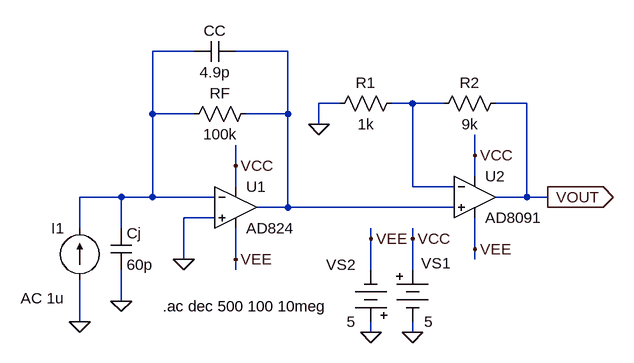
[diagram p0: schematic fig-03-03-19.asc]
fig-03-03-19.asc, the LTspice schematic file:
Version 4
SHEET 1 1132 680
WIRE 144 -64 80 -64
WIRE 288 -64 208 -64
WIRE 368 16 336 16
WIRE 480 16 448 16
WIRE 528 16 480 16
WIRE 656 16 608 16
WIRE 80 32 80 -64
WIRE 144 32 80 32
WIRE 288 32 288 -64
WIRE 288 32 224 32
WIRE 336 48 336 16
WIRE 576 96 576 64
WIRE 208 112 208 80
WIRE 576 128 576 96
WIRE 208 144 208 112
WIRE 480 144 480 16
WIRE 544 144 480 144
WIRE 32 160 -32 160
WIRE 80 160 80 32
WIRE 80 160 32 160
WIRE 176 160 80 160
WIRE 656 160 656 16
WIRE 656 160 608 160
WIRE 688 160 656 160
WIRE 288 176 288 32
WIRE 288 176 240 176
WIRE 544 176 288 176
WIRE 176 192 128 192
WIRE -32 208 -32 160
WIRE 32 208 32 160
WIRE 416 224 416 208
WIRE 480 224 480 208
WIRE 576 240 576 192
WIRE 128 256 128 192
WIRE 208 256 208 208
WIRE 576 256 576 240
WIRE 208 272 208 256
WIRE 416 272 416 224
WIRE 480 272 480 224
WIRE 32 320 32 272
WIRE -32 352 -32 288
WIRE 416 368 416 352
WIRE 480 368 480 352
FLAG 128 256 0
FLAG -32 352 0
FLAG 688 160 VOUT
IOPIN 688 160 Out
FLAG 416 368 0
FLAG 480 368 0
FLAG 416 224 VEE
FLAG 480 224 VCC
FLAG 208 112 VCC
FLAG 208 256 VEE
FLAG 32 320 0
FLAG 576 96 VCC
FLAG 576 240 VEE
FLAG 336 48 0
SYMBOL res 240 16 R90
WINDOW 0 0 56 VBottom 2
WINDOW 3 32 56 VTop 2
SYMATTR InstName RF
SYMATTR Value 100k
SYMBOL Misc\\battery 480 256 R0
WINDOW 0 13 6 Left 2
WINDOW 3 18 96 Left 2
WINDOW 123 0 0 Left 0
WINDOW 39 0 0 Left 0
SYMATTR InstName VS1
SYMATTR Value 5
SYMBOL Misc\\battery 416 368 R180
WINDOW 0 24 104 Left 2
WINDOW 3 24 16 Left 2
WINDOW 123 0 0 Left 0
WINDOW 39 0 0 Left 0
SYMATTR InstName VS2
SYMATTR Value 5
SYMBOL Opamps\\AD824 208 112 R0
SYMATTR InstName U1
SYMBOL cap 16 208 R0
SYMATTR InstName Cj
SYMATTR Value 60p
SYMBOL current -32 288 R180
WINDOW 0 24 80 Left 2
WINDOW 3 24 0 Left 2
WINDOW 123 24 -28 Left 2
WINDOW 39 0 0 Left 0
SYMATTR InstName I1
SYMATTR Value ""
SYMATTR Value2 AC 1u
SYMBOL cap 208 -80 R90
WINDOW 0 0 32 VBottom 2
WINDOW 3 32 32 VTop 2
SYMATTR InstName CC
SYMATTR Value 4.9p
SYMBOL res 624 0 R90
WINDOW 0 0 56 VBottom 2
WINDOW 3 32 56 VTop 2
SYMATTR InstName R2
SYMATTR Value 9k
SYMBOL res 464 0 R90
WINDOW 0 0 56 VBottom 2
WINDOW 3 32 56 VTop 2
SYMATTR InstName R1
SYMATTR Value 1k
SYMBOL Opamps\\AD8091 576 96 R0
SYMATTR InstName U2
TEXT 96 328 Left 2 !.ac dec 500 100 10meg

The netlist it stands for:
* fig-03-03-19.asc
RF N002 N001 100k
VS1 VCC 0 5
VS2 0 VEE 5
XU1 0 N001 VCC VEE N002 AD824  ; pins In+ In- V+ V- OUT
Cj N001 0 60p
I1 0 N001 AC 1u
CC N002 N001 4.9p
R2 VOUT N003 9k
R1 N003 0 1k
XU2 N002 N003 VCC VEE VOUT AD8091  ; pins In+ In- V+ V- OUT
.ac dec 500 100 10meg
.backanno
.end